# Altium schematic sheet Sheet1.SchDoc
size A4; SheetNumber: 1; SheetTotal: 1
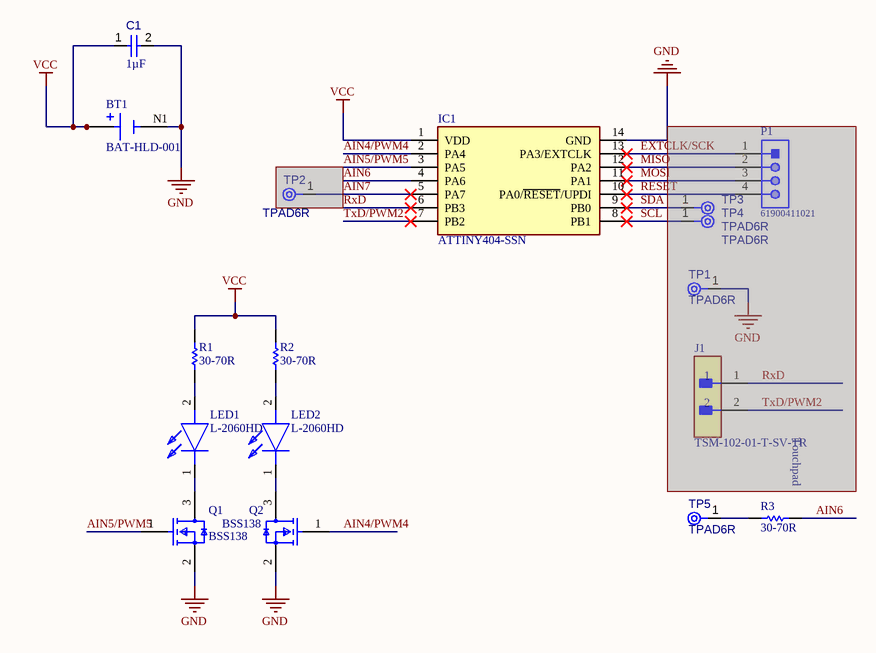
[diagram p0: Sheet1.SchDoc]

## Parts
BT1  BAT-HLD-001  [BAT_BAT-HLD-001]
C1  value 1µF  [CAPC3216X180X20ML20]  (hidden comment: Capacitor 1 uF +/- 10% 25 V 1206)
IC1  ATTINY404-SSN  [SOIC127P600X175-14N]
J1  TSM-102-01-T-SV-TR  [FP-TSM-102-01-T-SV-TR-MFG]  (masked out: inside a compile mask, not in the netlist)
LED1  L-2060HD  [L2060HD]
LED2  L-2060HD  [L2060HD]
P1  61900411021  [61900411021]  (masked out: inside a compile mask, not in the netlist)
Q1  BSS138  [FP-318-08-IPC_B]
Q2  BSS138  [FP-318-08-IPC_B]
R1  value 30-70R  [RESC3116X70X50ML13T20]  (hidden comment: Resistor 1k +/-1% 1206 250 mW)
R2  value 30-70R  [RESC3116X70X50ML13T20]  (hidden comment: Resistor 1k +/-1% 1206 250 mW)
R3  value 30-70R  [RESC3116X70X50ML13T20]  (hidden comment: Resistor 1k +/-1% 1206 250 mW)
TP1  TPAD6R  [TP06R]  (no BOM)  (masked out: inside a compile mask, not in the netlist)
TP2  TPAD6R  [TP06R]  (no BOM)  (masked out: inside a compile mask, not in the netlist)
TP3  TPAD6R  [TP06R]  (no BOM)  (masked out: inside a compile mask, not in the netlist)
TP4  TPAD6R  [TP06R]  (no BOM)  (masked out: inside a compile mask, not in the netlist)
TP5  TPAD6R  [TP06R]  (no BOM)

## Nets
GND: BT1.N1(NEG) C1.2 IC1.14(GND) Q1.2(S) Q2.2(S)
VCC: BT1.P1(POS) BT1.P2(POS) C1.1 IC1.1(VDD) R1.2 R2.2
AIN4/PWM4: IC1.2(PA4) Q2.1(G)
AIN5/PWM5: Q1.1(G)
AIN6: R3.1
EXTCLK/SCK: IC1.13(PA3/EXTCLK)
MISO: IC1.12(PA2)
MOSI: IC1.11(PA1)
RESET: IC1.10(PA0/~{RESET}/UPDI)
SCL: IC1.8(PB1)
SDA: IC1.9(PB0)
TxD/PWM2: IC1.7(PB2)
NetLED1_1: LED1.1(K) Q1.3(D)
NetLED1_2: LED1.2(A) R1.1
NetLED2_1: LED2.1(K) Q2.3(D)
NetLED2_2: LED2.2(A) R2.1
NetR3_2: R3.2 TP5.1(TP)

Not connected (* = marked no-connect by the designer): IC1 3(PA5) 4(PA6) 5(PA7)* 6(PB3)*

## Notes on the sheet
- (near R3) Touchpad

## Library data of the parts
BT1 = BAT-HLD-001: Battery Retainer Coin, 20.0mm 1 Cell SMD (SMT) Tab; MF: {'manufacturer': u'Linx'}; Availability: Unavailable; Price: None; MP: BAT-HLD-001; Package: None; Value: *
C1 = CMP-001-00006-5: Chip Capacitor, 1 uF, +/- 10%, 25 V, 1206 (3216 Metric); Capacitor Type: Ceramic; Voltage Rating: 25V; Max Operating Temperature: 125°C; Pins: 2; Mounting Technology: SM; RoHS Compliant: True; Min Operating Temperature: -55°C; Case/Package: 1206; Tolerance: 10%
IC1 = ATTINY404-SSN: Integrated Circuit; Manufacturer_Name: Microchip; Datasheet Link: https://componentsearchengine.com/Datasheets/2/ATTINY404-SSN.pdf; Height: 1.75mm; Manufacturer_Part_Number: ATTINY404-SSN; Mouser Part Number: 579-ATTINY404-SSN; Mouser Price/Stock: https://www.mouser.co.uk/ProductDetail/Microchip-Technology/ATTINY404-SSN?qs=3HJ2avRr9PJ8OrTjUlXZkg%3D%3D; Arrow Part Number: ATTINY404-SSN; Arrow Price/Stock: https://www.arrow.com/en/products/attiny404-ssn/microchip-technology?region=nac
J1 = CMP-02766-000113-1: CONN HEADER SMD 2POS 2.54MM; Gender: Male; Max Voltage Rating (AC): 475V; Number of Contacts: 2; Max Current Rating: 7A; Contact Material: Bronze; Min Operating Temperature: -55°C; REACH SVHC: No SVHC; Housing Material: Polymer; Lead Free: Lead Free; Orientation: Straight; Radiation Hardening: No; Number of Rows: 1; Length: 5.08mm; Housing Color: Black; Max Operating Temperature: 105°C; Contact Plating: Tin; Depth: 2.54mm; Packaging: Tape and Reel; Pitch: 2.54mm; Termination: Solder
LED1 LED2 = L-2060HD: LED; Manufacturer_Name: Kingbright; Datasheet Link: https://componentsearchengine.com/Datasheets/2/L-2060HD.pdf; Height: 4.35mm; Manufacturer_Part_Number: L-2060HD
P1 = CMP-1502-00594-1: Male Bottom Locking Header WR-WTB, THT, Right Angled, pitch 2.54 mm, 1 x 4 position; Manufacturer: Wurth Elektronik; Position: 1x4; Working Voltage: 250VAC; Pitch: 2.54mm; Contact Resistance: 20mOhm; Part Number: 61900411021; Operating Temperature: -40to105degC; Orientation: RightAngled; Packaging: Bag; Datasheet URL: https://katalog.we-online.de/em/datasheet/6190xx11021.pdf; Package Reference: 61900411021; Publisher: WurthElektronik; Mounting Technology: THT; Manufacturer URL: http://www.we-online.de; Gender: Male
Q1 Q2 = CMP-07173-000101-1: MOSFET N-CH 50V 220MA SOT-23; Turn-Off Delay Time: 20ns; Element Configuration: Single; Rds On Max: 3.5R; Gate to Source Voltage (Vgs): 20V; Threshold Voltage: 1.3V; Number of Elements: 1; Power Dissipation: 360mW; Rise Time: 9ns; Turn-On Delay Time: 2.5ns; Input Capacitance: 27pF; On-State Resistance: 6R; Lead Free: Lead Free; Length: 2.92mm; Width: 1.3mm; Drain to Source Breakdown Voltage: 50V; Min Operating Temperature: -55°C; REACH SVHC: No SVHC; Packaging: Tape and Reel; Radiation Hardening: No; Height: 0.93mm; Drain to Source Voltage (Vdss): 50V; Current Rating: 220mA; Voltage Rating (DC): 50V; Weight: 0.03g; Continuous Drain Current (ID): 220mA; Number of Pins: 3; Nominal Vgs: 1.3V; Max Power Dissipation: 360mW; Fall Time: 9ns; Drain to Source Resistance: 3.5R; Contact Plating: Tin; Case/Package: SOT-23; Package Quantity: 1; Dual Supply Voltage: 50V; Mount: Surface Mount; Termination: SMD/SMT; Max Operating Temperature: 150°C
R1-R3 = CMP-009-00011-4: Chip Resistor, 1 KOhm, +/- 1%, 0.25 W, -55 to 155 degC, 1206 (3216 Metric); Voltage Rating: 200V; Power: 250mW; Max Operating Temperature: 155°C; Case/Package: 1206; Pins: 2; RoHS Compliant: True; Min Operating Temperature: -55°C; Tolerance: 1%; Mounting Technology: SM
TP1-TP4 = CMP-00028-00002-1: 0.6mm round; Pins: 1
TP5 = CMP-00028-00002-1: Touchpad; Pins: 1